# EAGLE schematic Trace (EAGLE 6.6.0)
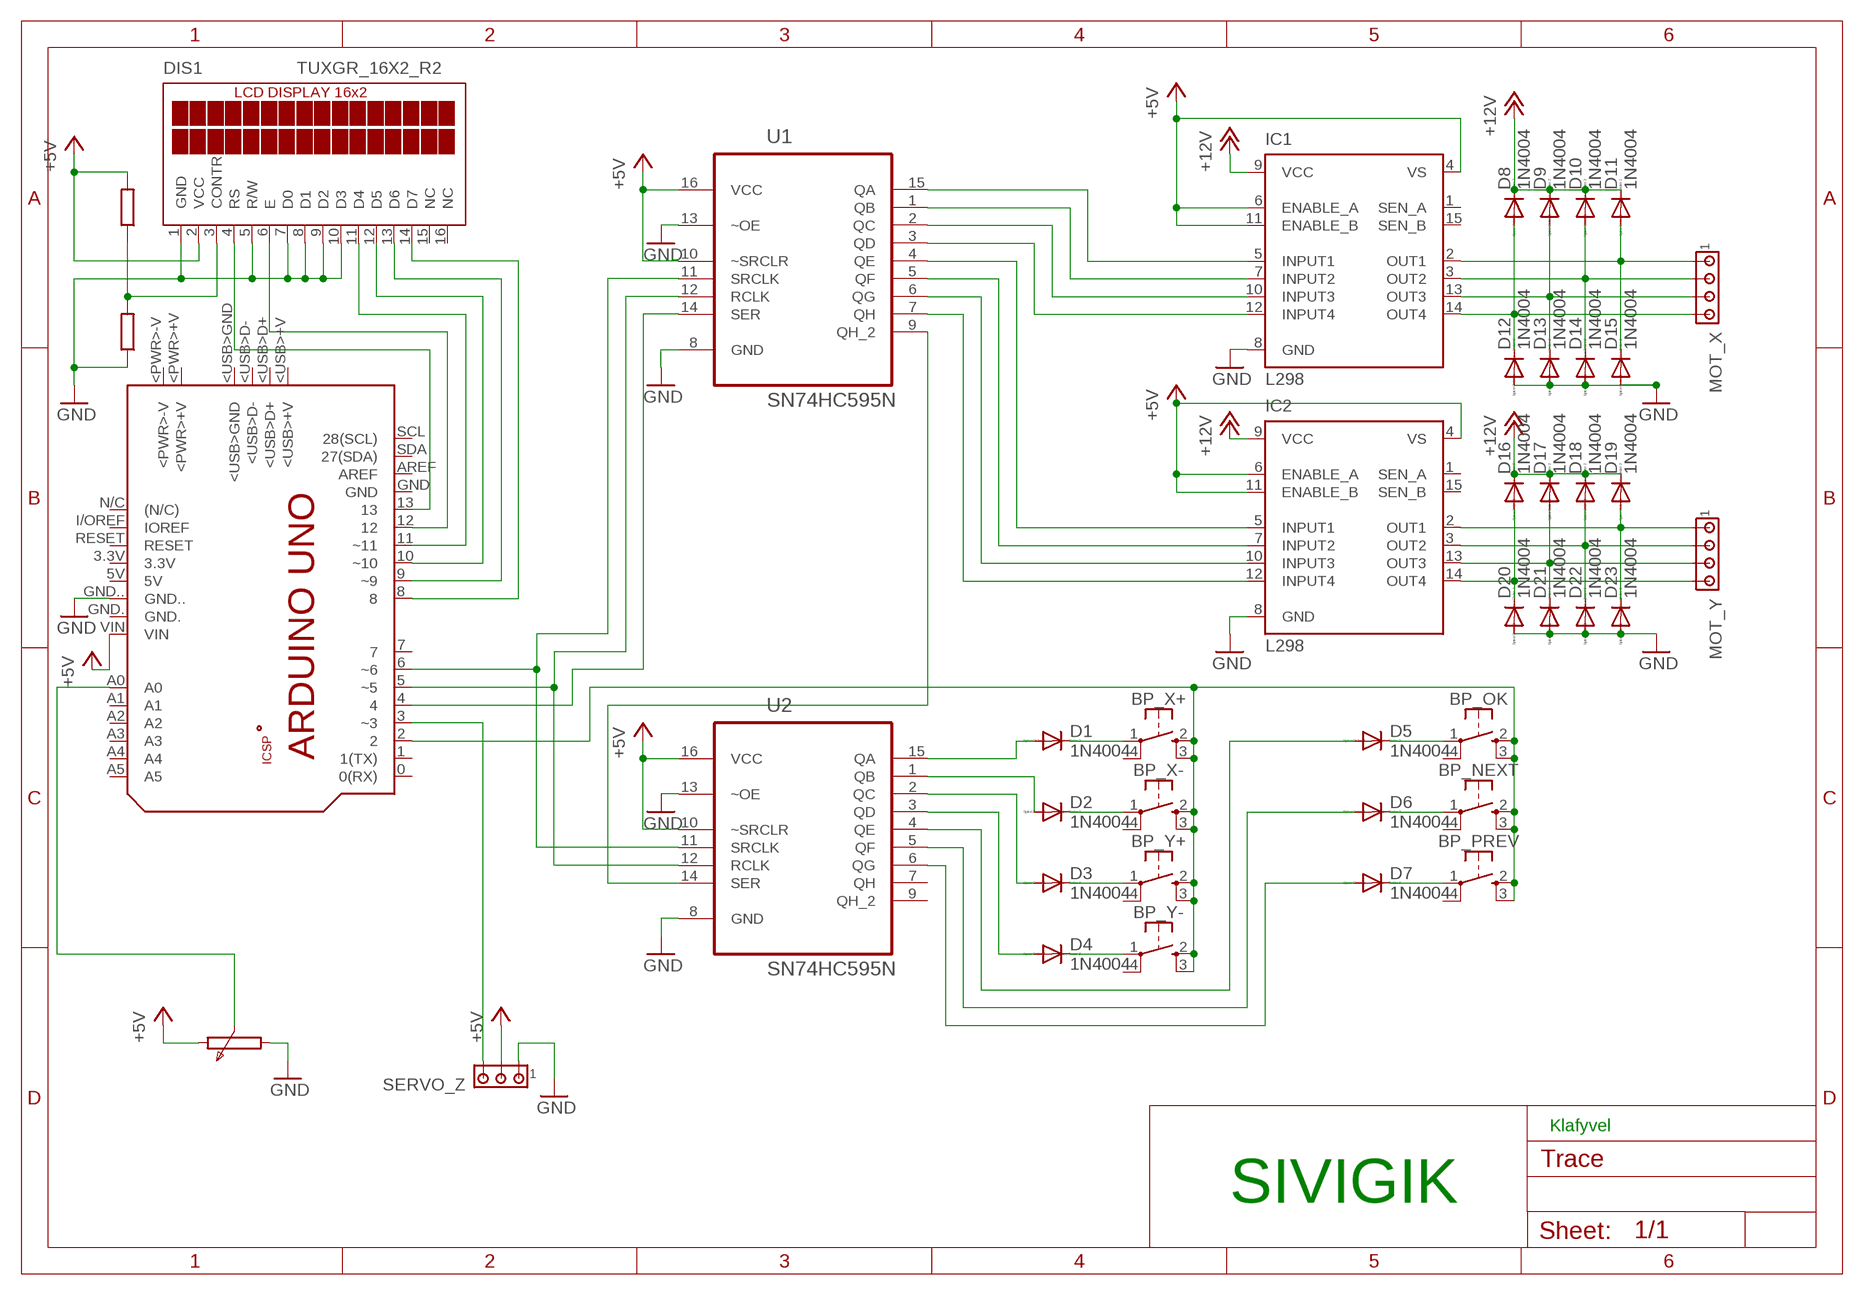
[diagram p0: schematic, sheet 1]

## Parts
BP_NEXT  SW-TACTILE-TL3315  [SW_TL3315N]
BP_OK  SW-TACTILE-TL3315  [SW_TL3315N]
BP_PREV  SW-TACTILE-TL3315  [SW_TL3315N]
BP_X+  SW-TACTILE-TL3315  [SW_TL3315N]
BP_X-  SW-TACTILE-TL3315  [SW_TL3315N]
BP_Y+  SW-TACTILE-TL3315  [SW_TL3315N]
BP_Y-  SW-TACTILE-TL3315  [SW_TL3315N]
D1  1N4004  [DO41-10]
D2  1N4004  [DO41-10]
D3  1N4004  [DO41-10]
D4  1N4004  [DO41-10]
D5  1N4004  [DO41-10]
D6  1N4004  [DO41-10]
D7  1N4004  [DO41-10]
D8  1N4004  [DO41-10]
D9  1N4004  [DO41-10]
D10  1N4004  [DO41-10]
D11  1N4004  [DO41-10]
D12  1N4004  [DO41-10]
D13  1N4004  [DO41-10]
D14  1N4004  [DO41-10]
D15  1N4004  [DO41-10]
D16  1N4004  [DO41-10]
D17  1N4004  [DO41-10]
D18  1N4004  [DO41-10]
D19  1N4004  [DO41-10]
D20  1N4004  [DO41-10]
D21  1N4004  [DO41-10]
D22  1N4004  [DO41-10]
D23  1N4004  [DO41-10]
DIS1  TUXGR_16X2_R2  [TUXGR_16X2_R2]
IC1  L298  [MULTIWATT-15]
IC2  L298  [MULTIWATT-15]
MOT_X  MTA04-100  [10X04MTA]
MOT_Y  MTA04-100  [10X04MTA]
PCB1  ARDUINO_UNO  [ARDUINO_UNO]
SERVO_Z  MTA03-100  [10X03MTA]
U1  SN74HC595N  [DIP254P762X508-16]
U2  SN74HC595N  [DIP254P762X508-16]

## Nets
+5V: DIS1.2(VCC) IC1.4(VS) IC1.6(ENABLE_A) IC1.11(ENABLE_B) IC2.4(VS) IC2.6(ENABLE_A) IC2.11(ENABLE_B) PCB1.VIN SERVO_Z.2 U1.10(~SRCLR) U1.16(VCC) U2.10(~SRCLR) U2.16(VCC)
+12V: D8.C D9.C D10.C D11.C D16.C D17.C D18.C D19.C IC1.9(VCC) IC2.9(VCC)
GND: D12.A D13.A D14.A D15.A D20.A D21.A D22.A D23.A DIS1.1(GND) DIS1.5(R/W) DIS1.7(D0) DIS1.8(D1) DIS1.9(D2) DIS1.10(D3) IC1.8(GND) IC2.8(GND) PCB1.GND.. SERVO_Z.1 U1.8(GND) U1.13(~OE) U2.8(GND) U2.13(~OE)
N$1: IC1.5(INPUT1) U1.15(QA)
N$2: IC1.7(INPUT2) U1.1(QB)
N$3: IC1.10(INPUT3) U1.2(QC)
N$4: IC1.12(INPUT4) U1.3(QD)
N$5: IC2.5(INPUT1) U1.4(QE)
N$6: IC2.7(INPUT2) U1.5(QF)
N$7: IC2.10(INPUT3) U1.6(QG)
N$8: IC2.12(INPUT4) U1.7(QH)
N$9: PCB1.3(~3) SERVO_Z.3
N$10: D11.A D15.C IC1.2(OUT1) MOT_X.1
N$11: D10.A D14.C IC1.3(OUT2) MOT_X.2
N$12: D9.A D13.C IC1.13(OUT3) MOT_X.3
N$13: D8.A D12.C IC1.14(OUT4) MOT_X.4
N$14: D19.A D23.C IC2.2(OUT1) MOT_Y.1
N$15: D18.A D22.C IC2.3(OUT2) MOT_Y.2
N$16: D17.A D21.C IC2.13(OUT3) MOT_Y.3
N$17: D16.A D20.C IC2.14(OUT4) MOT_Y.4
N$18: D1.A U2.15(QA)
N$19: D2.A U2.1(QB)
N$20: D3.A U2.2(QC)
N$21: D4.A U2.3(QD)
N$22: D5.A U2.4(QE)
N$23: D6.A U2.5(QF)
N$24: D7.A U2.6(QG)
N$25: BP_X+.1 D1.C
N$26: BP_X-.1 D2.C
N$27: BP_Y+.1 D3.C
N$28: BP_Y-.1 D4.C
N$29: PCB1.4 U1.14(SER)
N$30: BP_NEXT.2(S1) BP_NEXT.3(S2) BP_OK.2(S1) BP_OK.3(S2) BP_PREV.2(S1) BP_PREV.3(S2) BP_X+.2(S1) BP_X+.3(S2) BP_X-.2(S1) BP_X-.3(S2) BP_Y+.2(S1) BP_Y+.3(S2) BP_Y-.2(S1) BP_Y-.3(S2) PCB1.2
N$31: U1.9(QH_2) U2.14(SER)
N$32: PCB1.5(~5) U1.12(RCLK) U2.12(RCLK)
N$33: PCB1.6(~6) U1.11(SRCLK) U2.11(SRCLK)
N$34: BP_PREV.1 D7.C
N$35: BP_NEXT.1 D6.C
N$36: BP_OK.1 D5.C
N$37: DIS1.4(RS) PCB1.13
N$38: DIS1.6(E) PCB1.12
N$39: DIS1.11(D4) PCB1.11(~11)
N$40: DIS1.12(D5) PCB1.10(~10)
N$41: DIS1.13(D6) PCB1.9(~9)
N$42: DIS1.14(D7) PCB1.8
N$43: PCB1.A0
N$45: DIS1.3(CONTR)
Unconnected: BP_NEXT.4(P2) BP_OK.4(P2) BP_PREV.4(P2) BP_X+.4(P2) BP_X-.4(P2) BP_Y+.4(P2) BP_Y-.4(P2) DIS1.15(NC) DIS1.16(NC) IC1.1(SEN_A) IC1.15(SEN_B) IC2.1(SEN_A) IC2.15(SEN_B) PCB1.0(0(RX)) PCB1.1(1(TX)) PCB1.3.3V PCB1.5V PCB1.7 PCB1.+5V PCB1.<PWR>+V PCB1.<PWR>-V PCB1.<USB>+V PCB1.<USB>D+ PCB1.<USB>D- PCB1.<USB>GND PCB1.A1 PCB1.A2 PCB1.A3 PCB1.A4 PCB1.A5 PCB1.AREF PCB1.GND PCB1.GND. PCB1.GND_ PCB1.I/OREF(IOREF) PCB1.MISO PCB1.MOSI PCB1.N/C((N/C)) PCB1.RESET PCB1.RESET. PCB1.SCK PCB1.SCL(28(SCL)) PCB1.SDA(27(SDA)) U2.7(QH) U2.9(QH_2)

## Notes on the sheet
- Klafyvel
- SIVIGIK

## Library data of the parts
BP_NEXT BP_OK BP_PREV BP_X+ BP_X- BP_Y+ BP_Y- = we-switch:SW-TACTILE: Tactile Switches; DIGIKEY: EG4621TR-ND
D1-D23 = diode:1N4004: DIODE general purpose rectifier, 1 A
DIS1 = display-lcd:TUXGR_16X2_R2: Tuxgraphics LCD display 16x2 characters reflective, without background light Source: tuxgr_12x2_r2.pdf; OC_FARNELL: unknown; OC_NEWARK: unknown
IC1 IC2 = st-microelectronics:L298: DUAL FULL-BRIDGE DRIVER; MPN: L298N; OC_FARNELL: 1589425; OC_NEWARK: 32M1527
MOT_X MOT_Y = con-amp:MTA04-100: AMP connector
PCB1 = E14_Arduino:ARDUINO_UNO: Device for representing an Arduino Uno board with a footprint in an EAGLE design. Created by Dave Young for Element14. More EAGLE documentation at: http://www.element14.com/community/community/knode/cadsoft_eagle
SERVO_Z = con-amp:MTA03-100: AMP connector
U1 U2 = 74HC595:SN74HC595N: 8-BIT SHIFT REGISTERS WITH 3-STATE OUTPUT REGISTERS; MPN: SN74HC595N; OC_FARNELL: 9591664; OC_NEWARK: 60K6845; PACKAGE: PDIP-16; SUPPLIER: Texas Instruments